# Altium schematic sheet edge.SchDoc
size A3; SheetNumber: 9; SheetTotal: 11
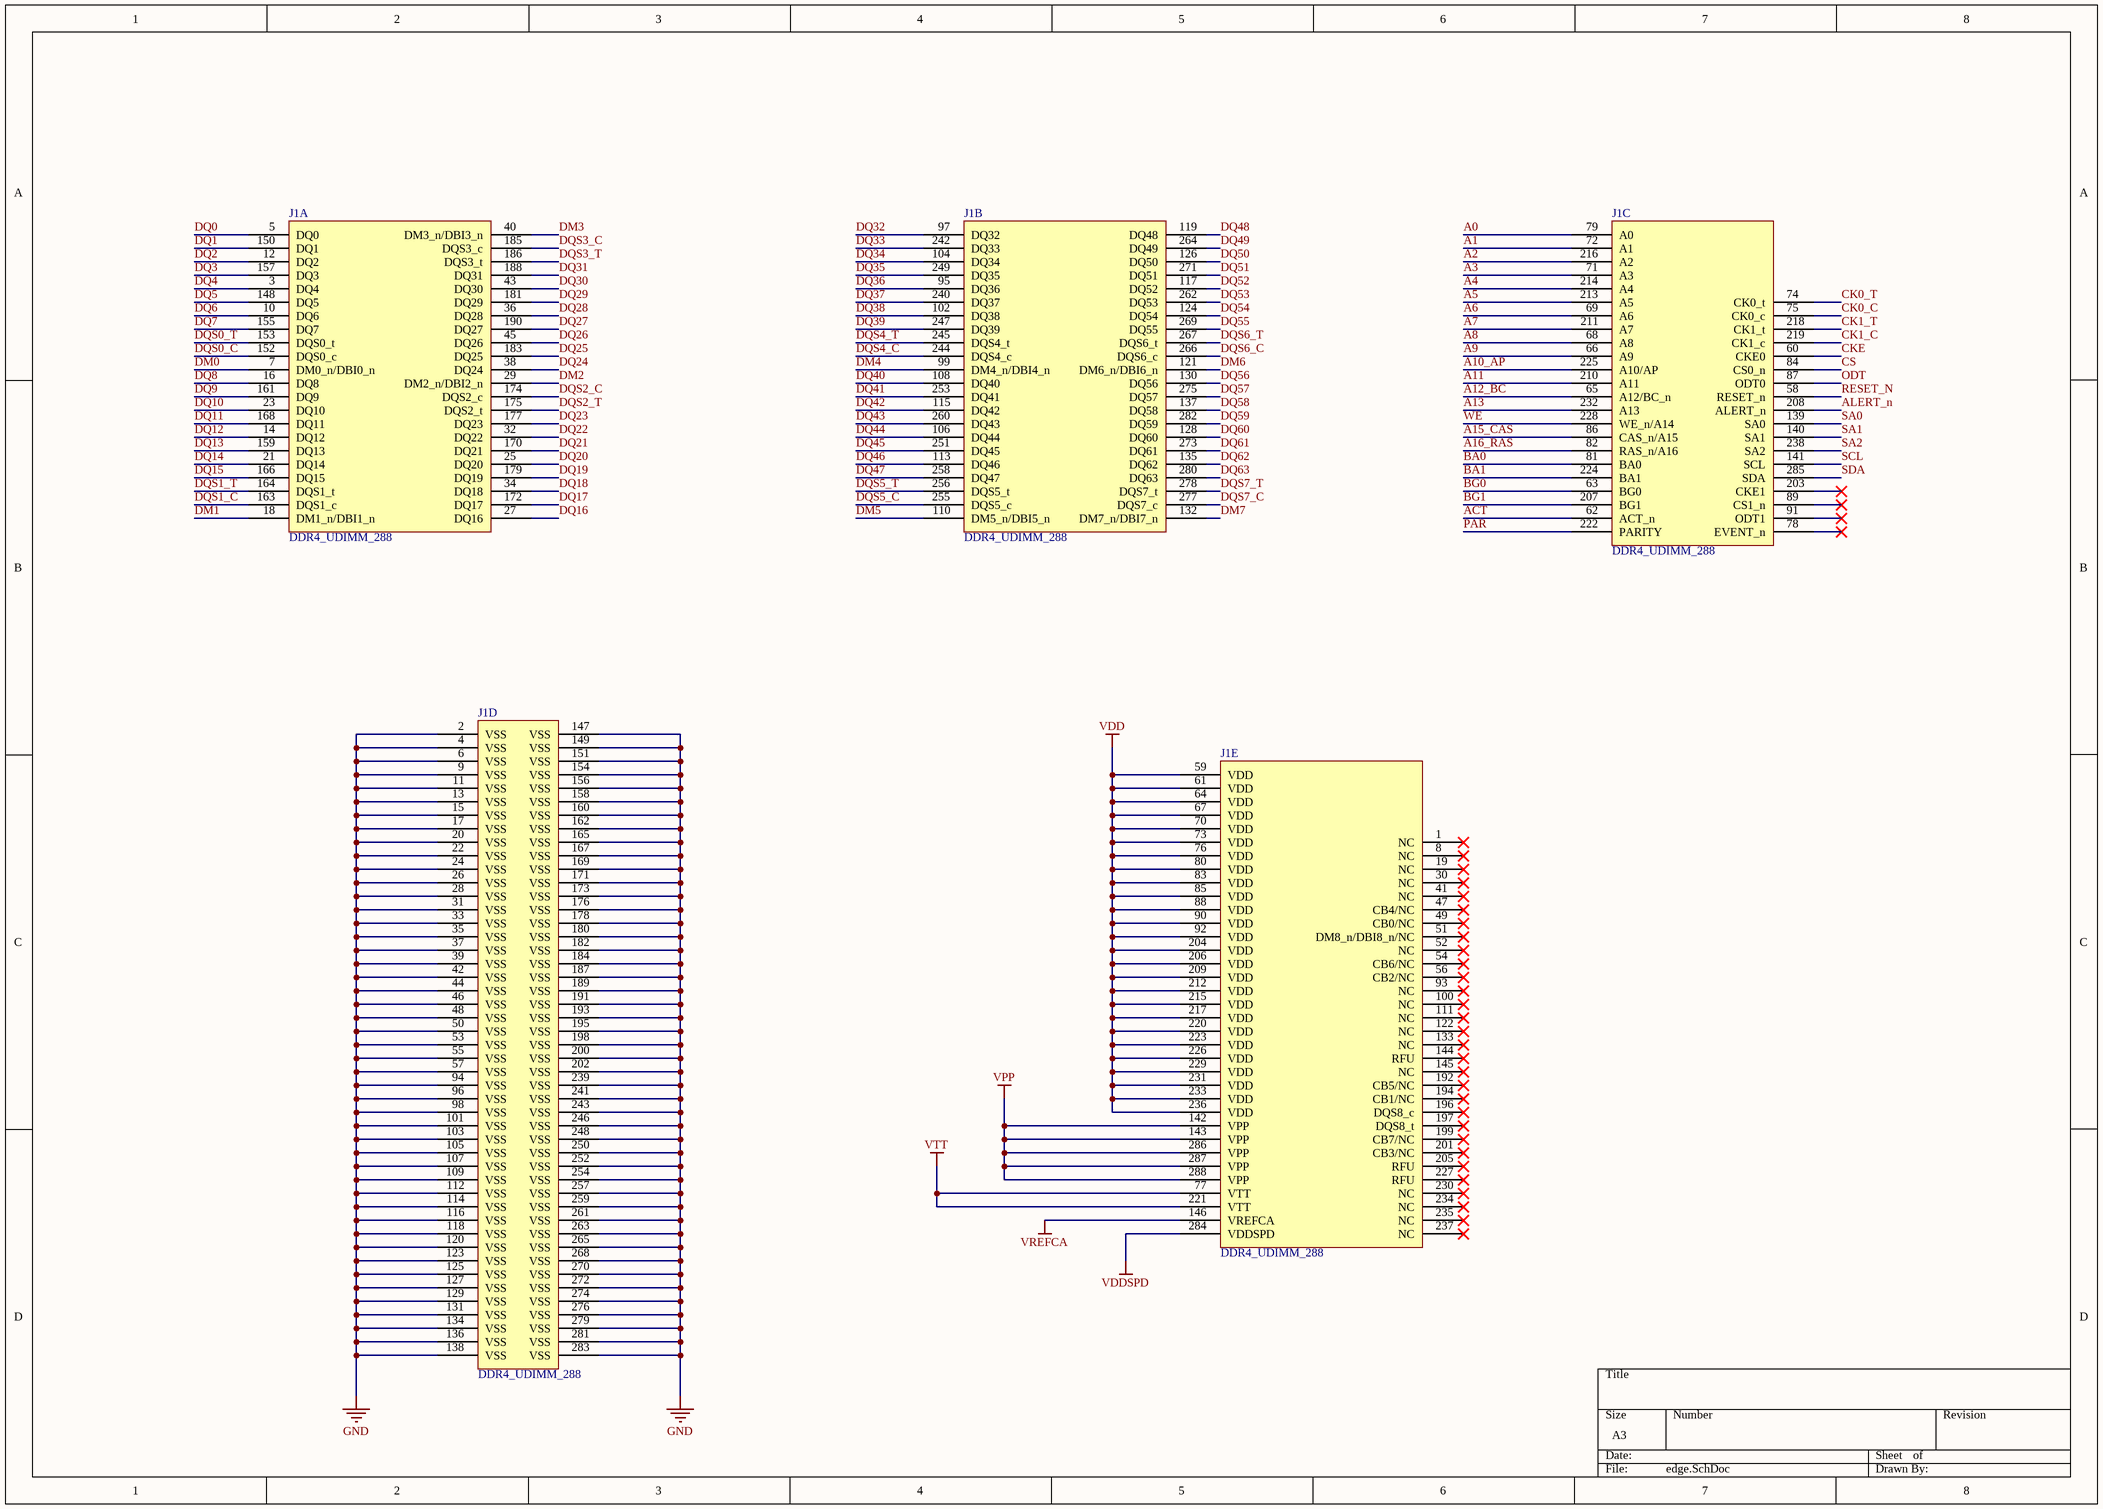
[diagram p0: edge.SchDoc]

## Parts
J1  DDR4_UDIMM_288  [DDR4_UDIMM_288_MO309]  (parts A,B,C,D,E of 5)

## Nets
GND: J1.2(VSS) J1.4(VSS) J1.6(VSS) J1.9(VSS) J1.11(VSS) J1.13(VSS) J1.15(VSS) J1.17(VSS) J1.20(VSS) J1.22(VSS) J1.24(VSS) J1.26(VSS) J1.28(VSS) J1.31(VSS) J1.33(VSS) J1.35(VSS) J1.37(VSS) J1.39(VSS) J1.42(VSS) J1.44(VSS) J1.46(VSS) J1.48(VSS) J1.50(VSS) J1.53(VSS) J1.55(VSS) J1.57(VSS) J1.94(VSS) J1.96(VSS) J1.98(VSS) J1.101(VSS) J1.103(VSS) J1.105(VSS) J1.107(VSS) J1.109(VSS) J1.112(VSS) J1.114(VSS) J1.116(VSS) J1.118(VSS) J1.120(VSS) J1.123(VSS) J1.125(VSS) J1.127(VSS) J1.129(VSS) J1.131(VSS) J1.134(VSS) J1.136(VSS) J1.138(VSS) J1.147(VSS) J1.149(VSS) J1.151(VSS) J1.154(VSS) J1.156(VSS) J1.158(VSS) J1.160(VSS) J1.162(VSS) J1.165(VSS) J1.167(VSS) J1.169(VSS) J1.171(VSS) J1.173(VSS) J1.176(VSS) J1.178(VSS) J1.180(VSS) J1.182(VSS) J1.184(VSS) J1.187(VSS) J1.189(VSS) J1.191(VSS) J1.193(VSS) J1.195(VSS) J1.198(VSS) J1.200(VSS) J1.202(VSS) J1.239(VSS) J1.241(VSS) J1.243(VSS) J1.246(VSS) J1.248(VSS) J1.250(VSS) J1.252(VSS) J1.254(VSS) J1.257(VSS) J1.259(VSS) J1.261(VSS) J1.263(VSS) J1.265(VSS) J1.268(VSS) J1.270(VSS) J1.272(VSS) J1.274(VSS) J1.276(VSS) J1.279(VSS) J1.281(VSS) J1.283(VSS)
VDD: J1.59(VDD) J1.61(VDD) J1.64(VDD) J1.67(VDD) J1.70(VDD) J1.73(VDD) J1.76(VDD) J1.80(VDD) J1.83(VDD) J1.85(VDD) J1.88(VDD) J1.90(VDD) J1.92(VDD) J1.204(VDD) J1.206(VDD) J1.209(VDD) J1.212(VDD) J1.215(VDD) J1.217(VDD) J1.220(VDD) J1.223(VDD) J1.226(VDD) J1.229(VDD) J1.231(VDD) J1.233(VDD) J1.236(VDD)
VDDSPD: J1.284(VDDSPD)
VPP: J1.142(VPP) J1.143(VPP) J1.286(VPP) J1.287(VPP) J1.288(VPP)
VREFCA: J1.146(VREFCA)
VTT: J1.77(VTT) J1.221(VTT)
A0: J1.79(A0)
A1: J1.72(A1)
A2: J1.216(A2)
A3: J1.71(A3)
A4: J1.214(A4)
A5: J1.213(A5)
A6: J1.69(A6)
A7: J1.211(A7)
A8: J1.68(A8)
A9: J1.66(A9)
A10_AP: J1.225(A10/AP)
A11: J1.210(A11)
A12_BC: J1.65(A12/BC_n)
A13: J1.232(A13)
A15_CAS: J1.86(CAS_n/A15)
A16_RAS: J1.82(RAS_n/A16)
ACT: J1.62(ACT_n)
ALERT_n: J1.208(ALERT_n)
BA0: J1.81(BA0)
BA1: J1.224(BA1)
BG0: J1.63(BG0)
BG1: J1.207(BG1)
CK0_C: J1.75(CK0_c)
CK0_T: J1.74(CK0_t)
CK1_C: J1.219(CK1_c)
CK1_T: J1.218(CK1_t)
CKE: J1.60(CKE0)
CS: J1.84(CS0_n)
DM0: J1.7(DM0_n/DBI0_n)
DM1: J1.18(DM1_n/DBI1_n)
DM2: J1.29(DM2_n/DBI2_n)
DM3: J1.40(DM3_n/DBI3_n)
DM4: J1.99(DM4_n/DBI4_n)
DM5: J1.110(DM5_n/DBI5_n)
DM6: J1.121(DM6_n/DBI6_n)
DM7: J1.132(DM7_n/DBI7_n)
DQ0: J1.5(DQ0)
DQ1: J1.150(DQ1)
DQ2: J1.12(DQ2)
DQ3: J1.157(DQ3)
DQ4: J1.3(DQ4)
DQ5: J1.148(DQ5)
DQ6: J1.10(DQ6)
DQ7: J1.155(DQ7)
DQ8: J1.16(DQ8)
DQ9: J1.161(DQ9)
DQ10: J1.23(DQ10)
DQ11: J1.168(DQ11)
DQ12: J1.14(DQ12)
DQ13: J1.159(DQ13)
DQ14: J1.21(DQ14)
DQ15: J1.166(DQ15)
DQ16: J1.27(DQ16)
DQ17: J1.172(DQ17)
DQ18: J1.34(DQ18)
DQ19: J1.179(DQ19)
DQ20: J1.25(DQ20)
DQ21: J1.170(DQ21)
DQ22: J1.32(DQ22)
DQ23: J1.177(DQ23)
DQ24: J1.38(DQ24)
DQ25: J1.183(DQ25)
DQ26: J1.45(DQ26)
DQ27: J1.190(DQ27)
DQ28: J1.36(DQ28)
DQ29: J1.181(DQ29)
DQ30: J1.43(DQ30)
DQ31: J1.188(DQ31)
DQ32: J1.97(DQ32)
DQ33: J1.242(DQ33)
DQ34: J1.104(DQ34)
DQ35: J1.249(DQ35)
DQ36: J1.95(DQ36)
DQ37: J1.240(DQ37)
DQ38: J1.102(DQ38)
DQ39: J1.247(DQ39)
DQ40: J1.108(DQ40)
DQ41: J1.253(DQ41)
DQ42: J1.115(DQ42)
DQ43: J1.260(DQ43)
DQ44: J1.106(DQ44)
DQ45: J1.251(DQ45)
DQ46: J1.113(DQ46)
DQ47: J1.258(DQ47)
DQ48: J1.119(DQ48)
DQ49: J1.264(DQ49)
DQ50: J1.126(DQ50)
DQ51: J1.271(DQ51)
DQ52: J1.117(DQ52)
DQ53: J1.262(DQ53)
DQ54: J1.124(DQ54)
DQ55: J1.269(DQ55)
DQ56: J1.130(DQ56)
DQ57: J1.275(DQ57)
DQ58: J1.137(DQ58)
DQ59: J1.282(DQ59)
DQ60: J1.128(DQ60)
DQ61: J1.273(DQ61)
DQ62: J1.135(DQ62)
DQ63: J1.280(DQ63)
DQS0_C: J1.152(DQS0_c)
DQS0_T: J1.153(DQS0_t)
DQS1_C: J1.163(DQS1_c)
DQS1_T: J1.164(DQS1_t)
DQS2_C: J1.174(DQS2_c)
DQS2_T: J1.175(DQS2_t)
DQS3_C: J1.185(DQS3_c)
DQS3_T: J1.186(DQS3_t)
DQS4_C: J1.244(DQS4_c)
DQS4_T: J1.245(DQS4_t)
DQS5_C: J1.255(DQS5_c)
DQS5_T: J1.256(DQS5_t)
DQS6_C: J1.266(DQS6_c)
DQS6_T: J1.267(DQS6_t)
DQS7_C: J1.277(DQS7_c)
DQS7_T: J1.278(DQS7_t)
ODT: J1.87(ODT0)
PAR: J1.222(PARITY)
RESET_N: J1.58(RESET_n)
SA0: J1.139(SA0)
SA1: J1.140(SA1)
SA2: J1.238(SA2)
SCL: J1.141(SCL)
SDA: J1.285(SDA)
WE: J1.228(WE_n/A14)

Not connected (* = marked no-connect by the designer): J1 1(NC)* 8(NC)* 19(NC)* 30(NC)* 41(NC)* 47(CB4/NC)* 49(CB0/NC)* 51(DM8_n/DBI8_n/NC)* 52(NC)* 54(CB6/NC)* 56(CB2/NC)* 78(EVENT_n)* 89(CS1_n)* 91(ODT1)* 93(NC)* 100(NC)* 111(NC)* 122(NC)* 133(NC)* 144(RFU)* 145(NC)* 192(CB5/NC)* 194(CB1/NC)* 196(DQS8_c)* 197(DQS8_t)* 199(CB7/NC)* 201(CB3/NC)* 203(CKE1)* 205(RFU)* 227(RFU)* 230(NC)* 234(NC)* 235(NC)* 237(NC)*

## Library data of the parts
J1 = Component_1: DDR4 288-pin UDIMM edge fingers, 0.85 mm pitch (JEDEC MO-309)